# Altium schematic sheet Top.SchDoc
size A4; SheetNumber: 1; SheetTotal: 5
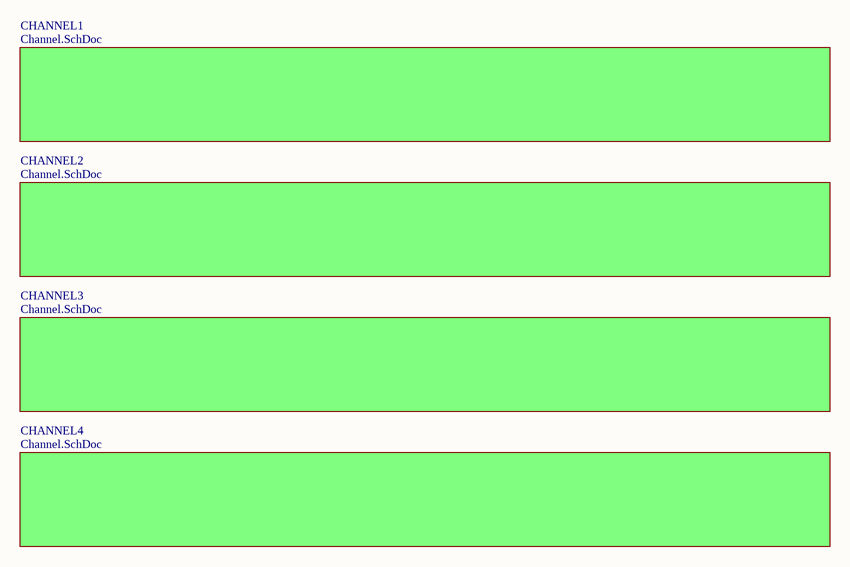
[diagram p0: Top.SchDoc]

## Sub-sheets
CHANNEL1 = Channel.SchDoc: no entries
CHANNEL2 = Channel.SchDoc: no entries
CHANNEL3 = Channel.SchDoc: no entries
CHANNEL4 = Channel.SchDoc: no entries